# Altium schematic sheet Sheet1.SCHDOC
size 279 x 215 mm; SheetNumber: 1; SheetTotal: 1; DocumentName: Sheet1.SCHDOC
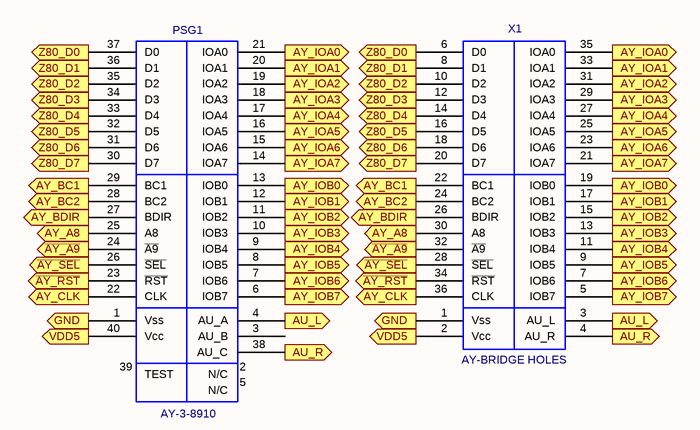
[diagram p0: Sheet1.SCHDOC]

## Parts
PSG1  AY-3-8910  [DIP40_AY-3-8910()]
X1  AY-BRIDGE HOLES  [DIP-HEAD-2X18_AY-BRIDGE HOLES()]

## Ports
AU_L (out), AU_R (out), AY_A8 (out), AY_BC1 (out), AY_BC2 (out), AY_BDIR (out), AY_CLK (out), AY_IOA0 (out), AY_IOA1 (out), AY_IOA2 (out), AY_IOA3 (out), AY_IOA4 (out), AY_IOA5 (out), AY_IOA6 (out), AY_IOA7 (out), AY_IOB0 (out), AY_IOB1 (out), AY_IOB2 (out), AY_IOB3 (out), AY_IOB4 (out), AY_IOB5 (out), AY_IOB6 (out), AY_IOB7 (out), GND (out), VDD5 (out), Z80_D0 (out), Z80_D1 (out), Z80_D2 (out), Z80_D3 (out), Z80_D4 (out), Z80_D5 (out), Z80_D6 (out), Z80_D7 (out), ~{AY_A9} (out), ~{AY_RST} (out), ~{AY_SEL} (out)

## Nets
~{AY_A9}: PSG1.24(~{A9}) X1.32(~{A9}) ; port ~{AY_A9}
~{AY_RST}: PSG1.23(~{RST}) X1.34(~{RST}) ; port ~{AY_RST}
~{AY_SEL}: PSG1.26(~{SEL}) X1.28(~{SEL}) ; port ~{AY_SEL}
AU_L: PSG1.4(AU_A) X1.3(AU_L) ; port AU_L
AU_R: PSG1.38(AU_C) X1.4(AU_R) ; port AU_R
AY_A8: PSG1.25(A8) X1.30(A8) ; port AY_A8
AY_BC1: PSG1.29(BC1) X1.22(BC1) ; port AY_BC1
AY_BC2: PSG1.28(BC2) X1.24(BC2) ; port AY_BC2
AY_BDIR: PSG1.27(BDIR) X1.26(BDIR) ; port AY_BDIR
AY_CLK: PSG1.22(CLK) X1.36(CLK) ; port AY_CLK
AY_IOA0: PSG1.21(IOA0) X1.35(IOA0) ; port AY_IOA0
AY_IOA1: PSG1.20(IOA1) X1.33(IOA1) ; port AY_IOA1
AY_IOA2: PSG1.19(IOA2) X1.31(IOA2) ; port AY_IOA2
AY_IOA3: PSG1.18(IOA3) X1.29(IOA3) ; port AY_IOA3
AY_IOA4: PSG1.17(IOA4) X1.27(IOA4) ; port AY_IOA4
AY_IOA5: PSG1.16(IOA5) X1.25(IOA5) ; port AY_IOA5
AY_IOA6: PSG1.15(IOA6) X1.23(IOA6) ; port AY_IOA6
AY_IOA7: PSG1.14(IOA7) X1.21(IOA7) ; port AY_IOA7
AY_IOB0: PSG1.13(IOB0) X1.19(IOB0) ; port AY_IOB0
AY_IOB1: PSG1.12(IOB1) X1.17(IOB1) ; port AY_IOB1
AY_IOB2: PSG1.11(IOB2) X1.15(IOB2) ; port AY_IOB2
AY_IOB3: PSG1.10(IOB3) X1.13(IOB3) ; port AY_IOB3
AY_IOB4: PSG1.9(IOB4) X1.11(IOB4) ; port AY_IOB4
AY_IOB5: PSG1.8(IOB5) X1.9(IOB5) ; port AY_IOB5
AY_IOB6: PSG1.7(IOB6) X1.7(IOB6) ; port AY_IOB6
AY_IOB7: PSG1.6(IOB7) X1.5(IOB7) ; port AY_IOB7
GND: PSG1.1(Vss) X1.1(Vss) ; port GND
VDD5: PSG1.40(Vcc) X1.2(Vcc) ; port VDD5
Z80_D0: PSG1.37(D0) X1.6(D0) ; port Z80_D0
Z80_D1: PSG1.36(D1) X1.8(D1) ; port Z80_D1
Z80_D2: PSG1.35(D2) X1.10(D2) ; port Z80_D2
Z80_D3: PSG1.34(D3) X1.12(D3) ; port Z80_D3
Z80_D4: PSG1.33(D4) X1.14(D4) ; port Z80_D4
Z80_D5: PSG1.32(D5) X1.16(D5) ; port Z80_D5
Z80_D6: PSG1.31(D6) X1.18(D6) ; port Z80_D6
Z80_D7: PSG1.30(D7) X1.20(D7) ; port Z80_D7

Not connected (* = marked no-connect by the designer): PSG1 2(N/C) 3(AU_B) 5(N/C) 39(TEST)

## Library data of the parts
PSG1 = AY-3-8910: Value: *
X1 = AY-BRIDGE HOLES: Value: *